# Altium project Power Board.PrjPcb
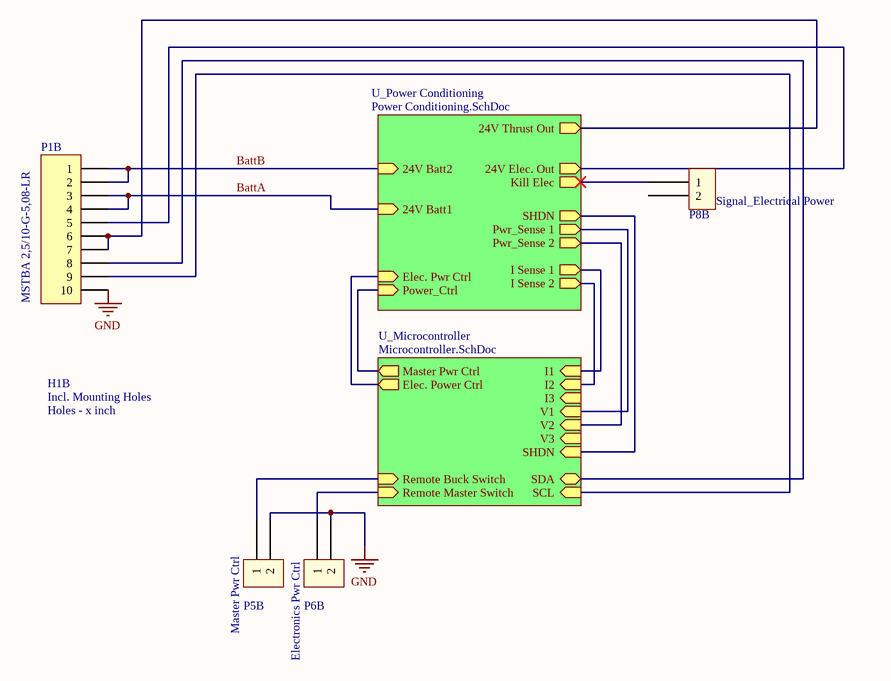
[diagram p0: Power Board.SchDoc]
4 sheets, 59 parts. Net scope: hierarchical (ports join the sheet entries above them; power ports are global).
Board file: Power Board.PcbDoc
Sheets:
  Power Board.SchDoc
    U_Microcontroller = Microcontroller.SchDoc
    U_Power Conditioning = Power Conditioning.SchDoc
      D = Diode Controllers.SchDoc
      D = Diode Controllers.SchDoc

## Sheet Power Board.SchDoc
size A; Organization: Underwater Robotics; Address1: c/o Student Involvement; Address2: Campus Box 7306; Address3: 2016 Cates Ave. Raleigh, NC 27695; Revision: A1; SheetNumber: 1B; SheetTotal: 4B

### Parts
H1B  Holes - x inch  [110mil Holes - 2.5  Inch]
P1B  Manufacturer Part Number: MSTBA 2,5/10-G-5,08-LR  [MSTBA 2,5/10-G-5,08]  (hidden comment: MSTBA 2,5/10-G-5,08)
P5B  Header  [1x2 Header]  (value not drawn)
P6B  Header  [1x2 Header]  (value not drawn)
P8B  Header  [1x2 Header]  (value not drawn)

### Sub-sheets
U_Microcontroller = Microcontroller.SchDoc: SDA (bidir), SCL (in), I1 (in), I2 (in), I3 (in), V1 (in), V2 (in), V3 (in), Master Pwr Ctrl (out), Elec. Power Ctrl (out), SHDN (in), Remote Buck Switch (in), Remote Master Switch (in)
U_Power Conditioning = Power Conditioning.SchDoc: 24V Elec. Out (out), Power_Ctrl (in), Pwr_Sense 1 (out), 24V Thrust Out (out), Pwr_Sense 2 (out), I Sense 1 (out), I Sense 2 (out), 24V Batt1 (in), 24V Batt2 (in), SHDN (out), Elec. Pwr Ctrl (in), Kill Elec (out)

### Nets
GND: P1B.10 P5B.2 P6B.2
BattA: P1B.3 P1B.4 ; sheet U_Power Conditioning/24V Batt1
BattB: P1B.1 P1B.2 ; sheet U_Power Conditioning/24V Batt2
Elec Pwr Ctrl Signal: P8B.1 ; sheet U_Microcontroller/Elec. Power Ctrl, sheet U_Power Conditioning/Elec. Pwr Ctrl, sheet U_Power Conditioning/Kill Elec
Rel1 Driver: sheet U_Microcontroller/Master Pwr Ctrl, sheet U_Power Conditioning/Power_Ctrl
SHDN_Signal: sheet U_Microcontroller/SHDN, sheet U_Power Conditioning/SHDN
NetP1B_5: P1B.5 ; sheet U_Power Conditioning/24V Elec. Out
NetP1B_6: P1B.6 P1B.7 ; sheet U_Power Conditioning/24V Thrust Out
NetP1B_8: P1B.8 ; sheet U_Microcontroller/SDA
NetP1B_9: P1B.9 ; sheet U_Microcontroller/SCL
NetP5B_1: P5B.1 ; sheet U_Microcontroller/Remote Buck Switch
NetP6B_1: P6B.1 ; sheet U_Microcontroller/Remote Master Switch
NetR1B_2: sheet U_Microcontroller/I1, sheet U_Power Conditioning/I Sense 1
NetR2B_2: sheet U_Microcontroller/I2, sheet U_Power Conditioning/I Sense 2
NetR4B_1: sheet U_Microcontroller/V1, sheet U_Power Conditioning/Pwr_Sense 1
NetR5B_1: sheet U_Microcontroller/V2, sheet U_Power Conditioning/Pwr_Sense 2

Not connected (* = marked no-connect by the designer): P8B 2

### Notes on the sheet
- (near P8B) Signal_Electrical Power
- (near P5B) Master Pwr Ctrl
- Electronics Pwr Ctrl
- Title
- Size:
- Date:
- A
- Number:
- Time:
- Revision:
- Sheet
- of
- File:
- (in symbol Holes - x inch) Incl. Mounting Holes

### Library data of the parts
P1B = MSTBA 2,5/10-G-5,08: Header, 10-Pin; Manufacturer 1: PHOENIX CONTACT; Description 1: PHOENIX CONTACT - MSTBA 2,5/10-G-5,08-LR - TERMINAL BLOCK, HEADER, 10POS, TH; URL: http://www.mouser.com/ProductDetail/Phoenix-Contact/1792708/?qs=sGAEpiMZZMsDddcp1dBDJI66tvLKBAoKnRJwuCPjeJk%3d; Supplier 1: Newark; Supplier Part Number 1: 88W5041; RoHS: YES; Stock 1: 37; Pricing 1: 1=3.07, 100=2.89, 250=2.67, 500=2.55, 1000=2.27 (USD); ComponentLink1URL: http://www.farnell.com/datasheets/1702208.pdf; ComponentLink1Description: http://www.farnell.com/datasheets/1702208.pdf
P5B P6B P8B = 1x2 Header

## Sheet Microcontroller.SchDoc
size A; Organization: Underwater Robotics; Address1: c/o Student Involvement; Address2: Campus Box 7306; Address3: 2016 Cates Ave. Raleigh, NC 27695; Revision: A1; SheetNumber: 2B; SheetTotal: 4B
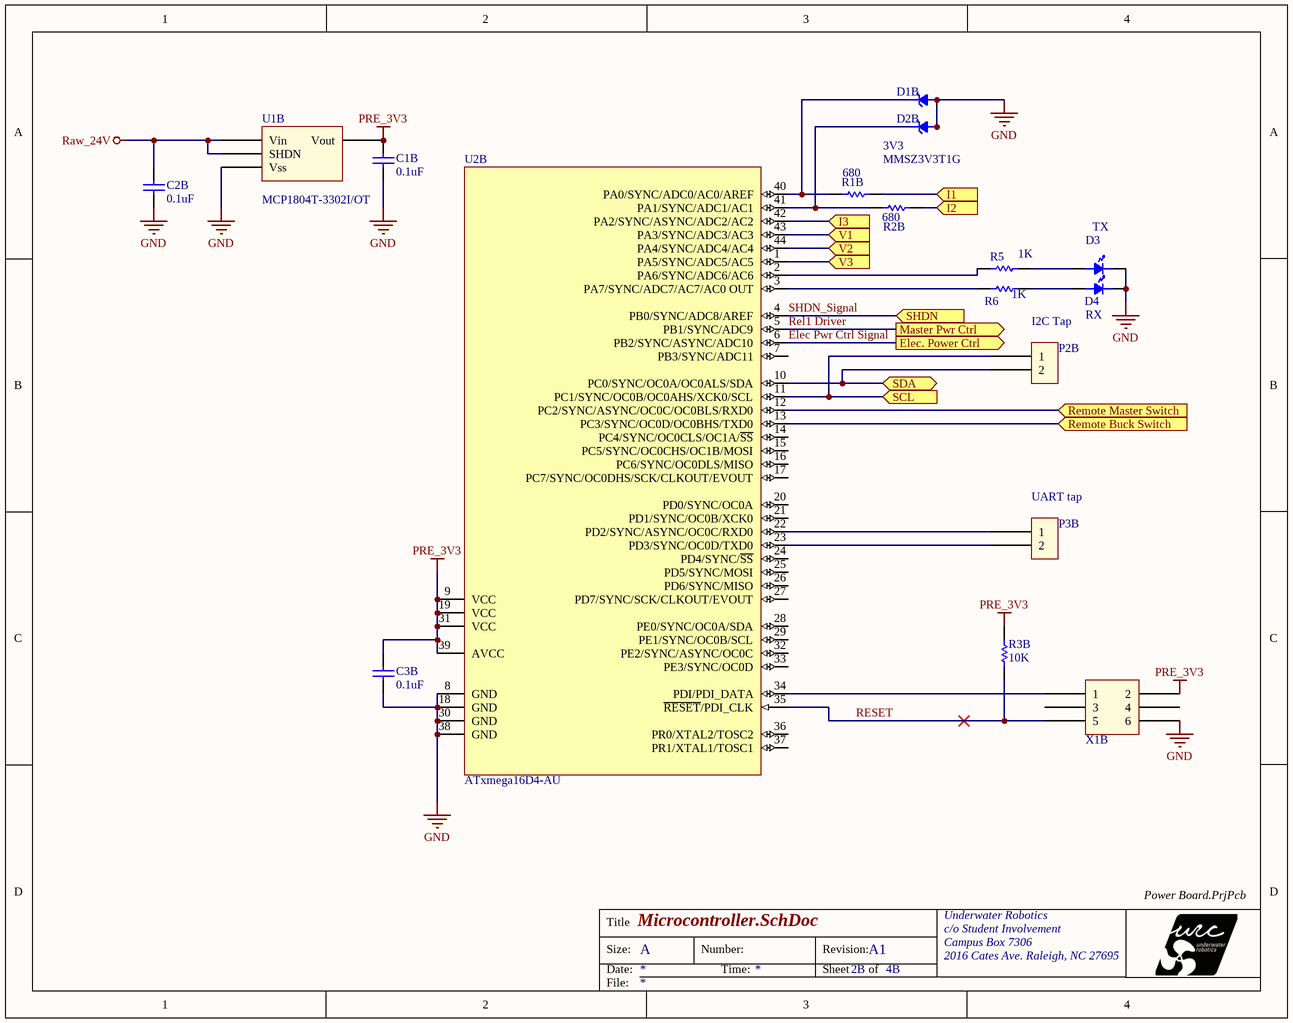
[diagram p1: Microcontroller.SchDoc]

### Parts
C1B  value 0.1uF  [C0805]  (hidden comment: 0.1uF, C0805, AVX)
C2B  value 0.1uF  [C0805]  (hidden comment: 0.1uF, C0805, AVX)
C3B  value 0.1uF  [C0805]  (hidden comment: 0.1uF, C0805, AVX)
D1B  value 3V3  Manufacturer Part Number: MMSZ3V3T1G  [ONSC-SOD123-2-498_A_V]  (hidden comment: MMSZ3V3T1G, 3V3 Zener Diode)
D2B  MMSZ3V3T1G, 3V3 Zener Diode  [ONSC-SOD123-2-498_A_V]  (value not drawn)
D3  LED  [LED0805]  (value not drawn)
D4  LED  [LED0805]  (value not drawn)
P2B  Header  [1x2 Header]  (value not drawn)
P3B  Header  [1x2 Header]  (value not drawn)
R1B  value 680  [R0603]  (hidden comment: Resistor)
R2B  value 680  [R0603]  (hidden comment: Resistor)
R3B  value 10K  [R0603]  (hidden comment: Resistor)
R5  value 1K  [R0603]  (hidden comment: Resistor)
R6  value 1K  [R0603]  (hidden comment: Resistor)
U1B  MCP1804T-3302I/OT  [MCP1804T-3302I/OT]
U2B  ATxmega16D4-AU  [44A_N]
X1B  Header  [2x3 Header]  (value not drawn)

### Ports
Elec. Power Ctrl (out), I1 (in), I2 (in), I3 (in), Master Pwr Ctrl (out), Remote Buck Switch (in), Remote Master Switch (in), SCL (in), SDA (bidir), SHDN (in), V1 (in), V2 (in), V3 (in)

### Nets
GND: C1B.2 C2B.2 C3B.2 D1B.A D2B.A D3.1 D4.1 U1B.Vss U2B.8(GND) U2B.18(GND) U2B.30(GND) U2B.38(GND) X1B.6
PRE_3V3: C1B.1(+) C3B.1(+) R3B.2 U1B.Vout U2B.9(VCC) U2B.19(VCC) U2B.31(VCC) U2B.39(AVCC) X1B.2
Raw_24V: C2B.1(+) U1B.SHDN U1B.Vin
Elec Pwr Ctrl Signal: U2B.6(PB2/SYNC/ASYNC/ADC10) ; port Elec. Power Ctrl
Rel1 Driver: U2B.5(PB1/SYNC/ADC9) ; port Master Pwr Ctrl
RESET: R3B.1 U2B.35(~{RESET}/PDI_CLK) X1B.5
SHDN_Signal: U2B.4(PB0/SYNC/ADC8/AREF) ; port SHDN
NetD1B_K: D1B.K R1B.1 U2B.40(PA0/SYNC/ADC0/AC0/AREF)
NetD2B_K: D2B.K R2B.1 U2B.41(PA1/SYNC/ADC1/AC1)
NetD3_2: D3.2 R5.2
NetD4_2: D4.2 R6.2
NetP1B_8: P2B.2 U2B.10(PC0/SYNC/OC0A/OC0ALS/SDA) ; port SDA
NetP1B_9: P2B.1 U2B.11(PC1/SYNC/OC0B/OC0AHS/XCK0/SCL) ; port SCL
NetP3B_1: P3B.1 U2B.22(PD2/SYNC/ASYNC/OC0C/RXD0)
NetP3B_2: P3B.2 U2B.23(PD3/SYNC/OC0D/TXD0)
NetP5B_1: U2B.13(PC3/SYNC/OC0D/OC0BHS/TXD0) ; port Remote Buck Switch
NetP6B_1: U2B.12(PC2/SYNC/ASYNC/OC0C/OC0BLS/RXD0) ; port Remote Master Switch
NetR1B_2: R1B.2 ; port I1
NetR2B_2: R2B.2 ; port I2
NetR4B_1: U2B.43(PA3/SYNC/ADC3/AC3) ; port V1
NetR5_1: R5.1 U2B.2(PA6/SYNC/ADC6/AC6)
NetR5B_1: U2B.44(PA4/SYNC/ADC4/AC4) ; port V2
NetR6_1: R6.1 U2B.3(PA7/SYNC/ADC7/AC7/AC0_OUT)
NetU2B_1: U2B.1(PA5/SYNC/ADC5/AC5) ; port V3
NetU2B_34: U2B.34(PDI/PDI_DATA) X1B.1
NetU2B_42: U2B.42(PA2/SYNC/ASYNC/ADC2/AC2) ; port I3

Not connected (* = marked no-connect by the designer): U2B 7(PB3/SYNC/ADC11) 14(PC4/SYNC/OC0CLS/OC1A/~{SS}) 15(PC5/SYNC/OC0CHS/OC1B/MOSI) 16(PC6/SYNC/OC0DLS/MISO) 17(PC7/SYNC/OC0DHS/SCK/CLKOUT/EVOUT) 20(PD0/SYNC/OC0A) 21(PD1/SYNC/OC0B/XCK0) 24(PD4/SYNC/~{SS}) 25(PD5/SYNC/MOSI) 26(PD6/SYNC/MISO) 27(PD7/SYNC/SCK/CLKOUT/EVOUT) 28(PE0/SYNC/OC0A/SDA) 29(PE1/SYNC/OC0B/SCL) 32(PE2/SYNC/ASYNC/OC0C) 33(PE3/SYNC/OC0D) 36(PR0/XTAL2/TOSC2) 37(PR1/XTAL1/TOSC1); X1B 3 4

### Notes on the sheet
- TX
- I2C Tap
- (near D4) RX
- (near P3B) UART tap
- Title
- Size:
- Date:
- A
- Number:
- Time:
- Revision:
- Sheet
- of
- File:

### Library data of the parts
C1B C2B C3B = 0.1uF, C0805, AVX: Ceramic MLCC, AVX, X5R Dielectric; Manufacturer Part Number: 08055C104JAT2A; Description 1: AVX - 08055C104JAT2A - MLCC CAPACITOR, 0.1uF, 50V, X7R, 5%, 0805; Capacitance: 0.1 F; Capacitance Tolerance: 5%; Dielectric Characteristic: X7; Voltage Rating: 50; Ceramic Capacitor Case: 0805 [2012 Metric]; Supplier 1: Newark; Supplier Part Number 1: 96K4778; Manufacturer 1: AVX; RoHS: YES; Stock 1: 26154; Pricing 1: 1=0.009, 10=0.009, 100=0.009, 250=0.009, 500=0.009, 1000=0.009 (USD); Product Range: -; Operating Temperature Min: -55 C; ComponentLink1URL: http://www.farnell.com/datasheets/1818074.pdf; ComponentLink1Description: http://www.farnell.com/datasheets/1818074.pdf
D1B D2B = MMSZ3V3T1G, 3V3 Zener Diode: 3V3 Zener Diode; Manufacturer 1: ON SEMICONDUCTOR; Description 1: ON SEMICONDUCTOR - MMSZ3V3T1G - ZENER DIODE, 500mW, 3.3V, SOD-123; Supplier 1: Newark; Supplier Part Number 1: 71J6023; RoHS: YES; Stock 1: 30308; Pricing 1: 1=0.24, 50=0.156, 100=0.065, 250=0.063, 500=0.061, 1000=0.044, 3000=0.035, 9000=0.029 (USD); ComponentLink1URL: http://www.farnell.com/datasheets/78656.pdf; ComponentLink1Description: http://www.farnell.com/datasheets/78656.pdf
  D2B: Manufacturer Part Number: MMSZ3V3T1G; Value: 3V3
P2B P3B = 1x2 Header
R1B R2B = 680, 5%, 100mW, Yageo, R0603: Manufacturer 1: YAGEO; Manufacturer Part Number: RC0603JR-07680RL; Tolerance: 5%; Description 1: YAGEO - RC0603JR-07680RL - RES, THICK FILM, 680R, 5%, 0.1W, 0603; Product Range: RC Series; Power Rating: 100; Voltage Rating: 50; Resistor Case Style: 0603 [1608 Metric]; Body Width: 0.8; Supplier 1: Newark; Supplier Part Number 1: 68R0206; RoHS: YESX; Stock 1: 8787; Pricing 1: 1=0.07, 10=0.012, 25=0.008, 100=0.005, 250=0.004, 1000=0.002 (USD); Resistance: 680; Resistance Tolerance: 5%; Packaging: Cut Tape; MSL: -; ComponentLink1URL: http://past.yageo.com/pdf/PYu-R_Packing_6.pdf; ComponentLink1Description: http://past.yageo.com/pdf/PYu-R_Packing_6.pdf; ComponentLink2URL: http://www.farnell.com/cad/1538988.zip; ComponentLink2Description: http://www.farnell.com/cad/1538988.zip; ComponentLink3URL: http://www.farnell.com/datasheets/1868787.pdf; ComponentLink3Description: http://www.farnell.com/datasheets/1868787.pdf; ComponentLink4URL: http://www.yageo.com/pdf/PYu-RC0603_51_RoHS_L_4.pdf; ComponentLink4Description: http://www.yageo.com/pdf/PYu-RC0603_51_RoHS_L_4.pdf
R3B = 10k, 1%, 100mW, Yageo, R0603: Manufacturer 1: YAGEO; Manufacturer Part Number: RC0603FR-1010KL; Tolerance: 1%; Description 1: YAGEO - RC0603FR-1010KL - RES, THICK FILM, 10K, 1%, 0.1W, 0603; Product Range: RC Series; Resistance: 10; Power Rating: 100; Voltage Rating: 50; Resistor Case Style: 0603 [1608 Metric]; Body Length: 1.6; Supplier 1: Newark; Supplier Part Number 1: 68R0120; RoHS: YESX; Stock 1: 7839; Pricing 1: 1=0.002, 10=0.002, 25=0.002, 100=0.002, 250=0.002, 1000=0.002 (USD); Resistance Tolerance: 1%; Packaging: Cut Tape; MSL: -; ComponentLink1URL: http://www.farnell.com/datasheets/1868787.pdf; ComponentLink1Description: http://www.farnell.com/datasheets/1868787.pdf; ComponentLink2URL: http://www.yageo.com/pdf/PYu-RC0603_51_RoHS_L_4.pdf; ComponentLink2Description: http://www.yageo.com/pdf/PYu-RC0603_51_RoHS_L_4.pdf
R5 R6 = 1k, 5%, 100mW, Yageo, R0603: Manufacturer 1: YAGEO; Manufacturer Part Number: RC0603JR-131KL; Tolerance: 5%; Description 1: YAGEO - RC0603JR-131KL - RES, THICK FILM, 1K, 5%, 0.1W, 0603; Product Range: RC Series; Resistance: 1; Power Rating: 100; Voltage Rating: 50; Resistor Case Style: 0603 [1608 Metric]; Body Height: 0.45; Supplier 1: Newark; Supplier Part Number 1: 68R0220; RoHS: YESX; Stock 1: 36430; Pricing 1: 1=0.06, 10=0.011, 25=0.008, 100=0.005, 250=0.003, 1000=0.002 (USD); Resistance Tolerance: 5%; Packaging: Cut Tape; MSL: -; ComponentLink1URL: http://www.farnell.com/datasheets/1868787.pdf; ComponentLink1Description: http://www.farnell.com/datasheets/1868787.pdf; ComponentLink2URL: http://www.yageo.com/pdf/PYu-RC0603_51_RoHS_L_4.pdf; ComponentLink2Description: http://www.yageo.com/pdf/PYu-RC0603_51_RoHS_L_4.pdf
U1B = MCP1804T-3302I/OT: 3.3V Linear Regulator; Manufacturer 1: MICROCHIP; Description 1: MICROCHIP - MCP1804T-3302I/OT - LDO VOLTAGE REGULATOR, 3.3V, 150mA, 5-SOT-23; Input Voltage Min: 2; Input Voltage Max: 28; Output Current: 150; Dropout Voltage Vdo: 260; LDO Regulator Case Style: SOT-23; No. of Pins: 5; URL: http://www.newark.com/microchip/mcp1804t-3302i-ot/ldo-voltage-regulator-3-3v-150ma/dp/55R1047; Supplier 1: Newark; Supplier Part Number 1: 55R1047; RoHS: YES; Stock 1: 12; Pricing 1: 1=0.67, 26=0.56, 100=0.51 (USD); Operating Temperature Min: -40 C; ComponentLink1URL: http://www.farnell.com/datasheets/1789199.pdf; ComponentLink1Description: http://www.farnell.com/datasheets/1789199.pdf; ComponentLink2URL: http://www.farnell.com/cad/1790647.zip; ComponentLink2Description: http://www.farnell.com/cad/1790647.zip; Manufacturer Part Number: MCP1804T-3302I/OT
U2B = ATxmega16D4-AU: 8/16-bit AVR XMEGA D4 Microcontroller, 1.6-3.6V, 32MHz, 16KB + 4KB Flash, 1KB EEPROM, 2KB SRAM, 44-pin TQFP, Industrial Grade (-40°C to 85°C), Pb-Free; Manufacturer 1: ATMEL; Description 1: ATMEL - ATXMEGA16D4-AU - MICROCONTROLLER MCU, 8 BIT, AVR XMEGA, 32MHZ, TQFP-44; CPU Speed: 32; Program Memory Size: 16; RAM Memory Size: 2; No. of Pins: 44; No. of I/O's: 34; Supply Voltage Min: 1.6; DatasheetVersion: revJ, Dec-2010; PackageVersion: revC, Oct-2010; PackageReference: 44A; PackageDescription: 44-Pin Plastic Thin Profile Quad Flat Pack, 10 x 10 x 1.0 mm Body, 0.8 mm Pitch (TQFP); Code_JEDEC: MS-026-ACB; ComponentLink1Description: Manufacturer URL; ComponentLink1URL: http://www.atmel.com/; ComponentLink2Description: ATxmega128D4/64D4/32D4/16D4 Datasheet; ComponentLink2URL: http://www.atmel.com/dyn/resources/prod_documents/doc8135.pdf; Supplier 1: Newark; Supplier Part Number 1: 68T3906; Manufacturer Part Number: ATXMEGA16D4-AU; RoHS: YES; Stock 1: 196; Pricing 1: 1=2.71, 10=2.38, 25=2.24, 50=1.9, 100=1.79, 250=1.72, 500=1.69, 1000=1.49 (USD); Controller Family/Series: ATxmega; MCU Case Style: TQFP; ComponentLink3URL: http://www.farnell.com/datasheets/1693882.pdf; ComponentLink3Description: http://www.farnell.com/datasheets/1693882.pdf; ComponentLink4URL: http://www.farnell.com/cad/1773743.zip; ComponentLink4Description: http://www.farnell.com/cad/1773743.zip; ComponentLink5URL: http://bcove.me/gu8hm7kh; ComponentLink5Description: http://bcove.me/gu8hm7kh
X1B = 2x3 Header: Manufacturer 1: FCI; Manufacturer Part Number: 67996-406HLF; Description 1: FCI - 67996-406HLF - BOARD-BOARD CONNECTOR HEADER, 6 POSITION, 2ROW; Product Range: BergStik 67996 Series; Contact Termination Type: Through Hole; No. of Contacts: 6; Pitch Spacing: 2.54; No. of Rows: 2; Supplier Part Number 1: 20M2191; Supplier 1: Newark; RoHS: YES; Stock 1: 441; Pricing 1: 1=0.254, 10=0.218, 25=0.186, 50=0.178, 100=0.16, 250=0.153, 500=0.128, 1000=0.117 (USD); Gender: Header; Contact Plating: Tin Plated Contacts; ComponentLink1URL: http://www.farnell.com/datasheets/1876884.pdf; ComponentLink1Description: http://www.farnell.com/datasheets/1876884.pdf

## Sheet Power Conditioning.SchDoc
size A; Organization: Underwater Robotics; Address1: c/o Student Involvement; Address2: Campus Box 7306; Address3: 2016 Cates Ave. Raleigh, NC 27695; Revision: A1; SheetNumber: 3B; SheetTotal: 3B; PageSetup: Record=PageOptions|CenterHorizontal=True|CenterVertical=True|PrintScale=1.00|XCorrection=1.00|YCorrection=1.00|PrintKind=0|BorderSize=5000000|LeftOffset=0|BottomOffset=0|Orientation=2|PaperLength=1000|PaperWidth=1000|Scale=100|PaperSource=7|PrintQuality=-3|MediaType=1|DitherType=10|PrintScaleMode=1|PaperKind=Letter|PaperIndex=1
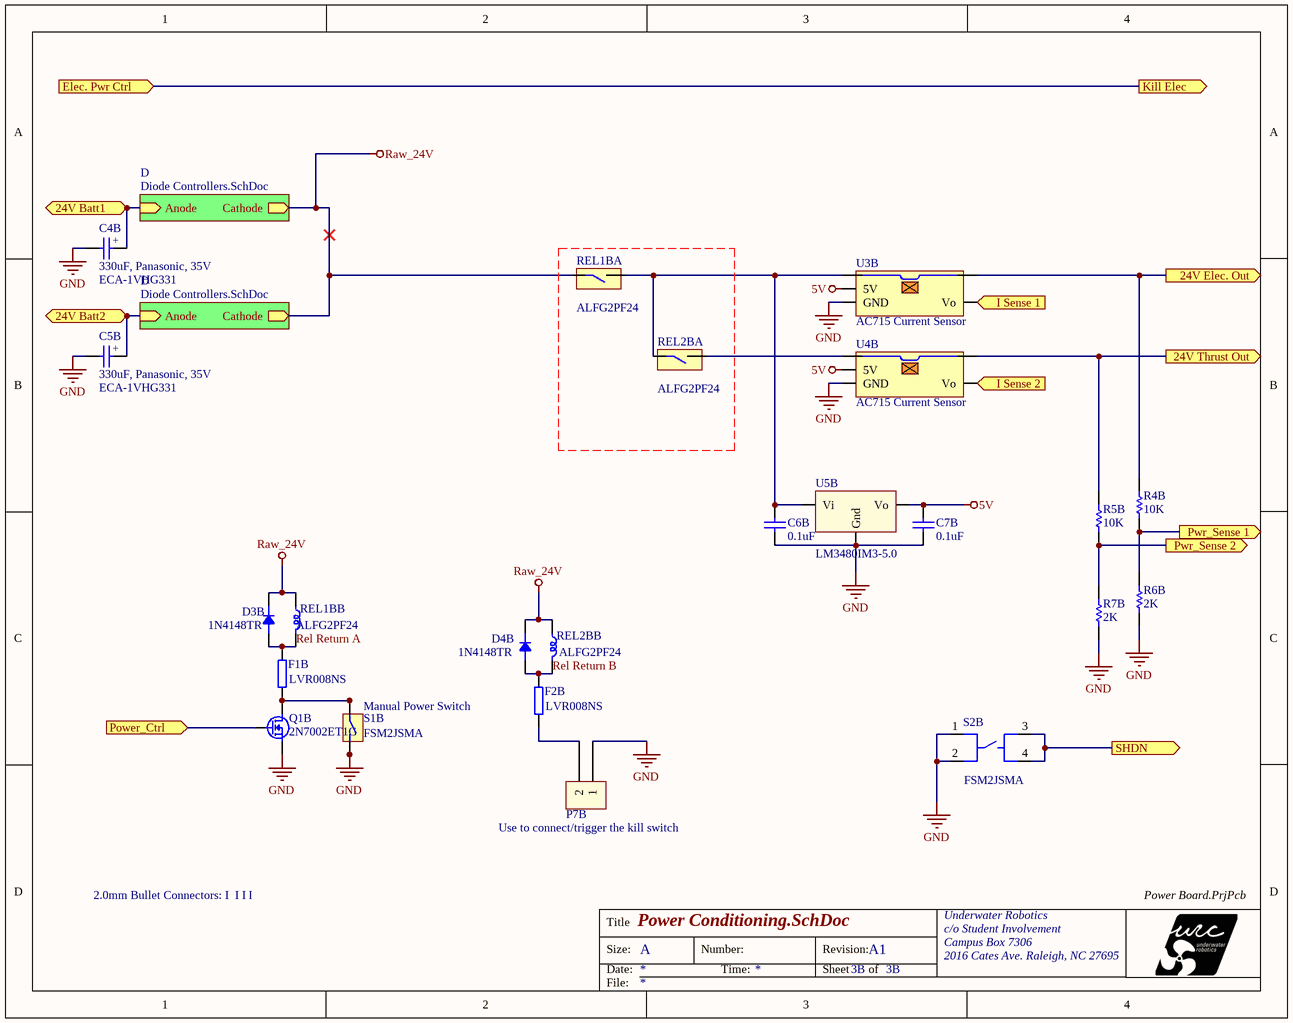
[diagram p2: Power Conditioning.SchDoc]

### Parts
C4B  330uF, Panasonic, 35V  Manufacturer Part Number: ECA-1VHG331  [10mm Radial Cap, Generic]
C5B  330uF, Panasonic, 35V  Manufacturer Part Number: ECA-1VHG331  [10mm Radial Cap, Generic]
C6B  value 0.1uF  [C0805]  (hidden comment: 0.1uF, C0805, AVX)
C7B  value 0.1uF  [C0805]  (hidden comment: 0.1uF, C0805, AVX)
D3B  Manufacturer Part Number: 1N4148TR  [DO-35-0.3]  (hidden comment: Diode)
D4B  Manufacturer Part Number: 1N4148TR  [DO-35-0.3]  (hidden comment: Diode)
F1B  Manufacturer Part Number: LVR008NS  [LVR008NS - Resettable Fuse]  (hidden comment: PTC Fuse, LVR008NS)
F2B  Manufacturer Part Number: LVR008NS  [LVR008NS - Resettable Fuse]  (hidden comment: PTC Fuse, LVR008NS)
i1B  2.0mm Bullet Connector (Placeholder)  (value not drawn)
i2B  2.0mm Bullet Connector (Placeholder)  (value not drawn)
i3B  2.0mm Bullet Connector (Placeholder)  (value not drawn)
i4B  2.0mm Bullet Connector (Placeholder)  (value not drawn)
P7B  Header  [1x2 Header]  (value not drawn)
Q1B  Manufacturer Part Number: 2N7002ET1G  [2N7002-SOT23]  (hidden comment: N-MOSFET)
R4B  value 10K  [R0603]  (hidden comment: Resistor)
R5B  value 10K  [R0603]  (hidden comment: Resistor)
R6B  value 2K  [R0603]  (hidden comment: Resistor)
R7B  value 2K  [R0603]  (hidden comment: Resistor)
REL1B  ALFG2PF24  [LF-G Series Relay]  (parts A,B of 2)
REL2B  ALFG2PF24  [LF-G Series Relay]  (parts A,B of 2)
S1B  FSM2JSMA  [FSM2JSMA]
S2B  FSM2JSMA  [FSM2JSMA]
U3B  AC715 Current Sensor  [AC715 Current Sensor]
U4B  AC715 Current Sensor  [AC715 Current Sensor]
U5B  Manufacturer Part Number: LM3480IM3-5.0  [LM4040-SOT23-3]  (hidden comment: LM3480)

### Sub-sheets
D = Diode Controllers.SchDoc: Anode (in), Cathode (out)
D = Diode Controllers.SchDoc: Anode (in), Cathode (out)

### Ports
24V Batt1 (in), 24V Batt2 (in), 24V Elec. Out (out), 24V Thrust Out (out), Elec. Pwr Ctrl (in), I Sense 1 (out), I Sense 2 (out), Kill Elec (out), Power_Ctrl (in), Pwr_Sense 1 (out), Pwr_Sense 2 (out), SHDN (out)

### Nets
5V: C7B.1(+) U3B.5(5V) U4B.5(5V) U5B.2(Vo)
GND: C4B.2 C5B.2 C6B.2 C7B.2 P7B.1 Q1B.S(SOURCE) R6B.1 R7B.1 S1B.3 S1B.4 S2B.1 S2B.2 U3B.3(GND) U4B.3(GND) U5B.1(Gnd)
Raw_24V: D3B.2 D4B.2 REL1B.2 REL1B.4 REL2B.2 ; sheet D/Cathode, sheet D/Cathode
BattA: C4B.1(+) ; port 24V Batt1, sheet D/Anode
BattB: C5B.1(+) ; port 24V Batt2, sheet D/Anode
Elec Pwr Ctrl Signal: port Elec. Pwr Ctrl, port Kill Elec
Rel1 Driver: Q1B.G(GATE) ; port Power_Ctrl
Rel Return A: D3B.1 F1B.1 REL1B.1
Rel Return B: D4B.1 F2B.1 REL2B.1
SHDN_Signal: S2B.3 S2B.4 ; port SHDN
NetC6B_1: C6B.1(+) REL1B.3 REL2B.4 U3B.1 U5B.3(Vi)
NetF1B_2: F1B.2 Q1B.D(DRAIN) S1B.1 S1B.2
NetF2B_2: F2B.2 P7B.2
NetP1B_5: R4B.2 U3B.2 ; port 24V Elec. Out
NetP1B_6: R5B.2 U4B.2 ; port 24V Thrust Out
NetR1B_2: U3B.4(Vo) ; port I Sense 1
NetR2B_2: U4B.4(Vo) ; port I Sense 2
NetR4B_1: R4B.1 R6B.2 ; port Pwr_Sense 1
NetR5B_1: R5B.1 R7B.2 ; port Pwr_Sense 2
NetREL2B_3: REL2B.3 U4B.1

### Notes on the sheet
- (near S1B) Manual Power Switch
- (near P7B) Use to connect/trigger the kill switch
- Title
- Size:
- Date:
- A
- Number:
- Time:
- Revision:
- Sheet
- of
- File:
- (in symbol 2.0mm Bullet Connector (Placeholder)) 2.0mm Bullet Connectors: I; I

### Library data of the parts
C4B C5B = 330uF, Panasonic, 35V: Manufacturer 1: PANASONIC ELECTRONIC COMPONENTS; Description 1: PANASONIC ELECTRONIC COMPONENTS - ECA-1VHG331 - ALUMINUM ELECTROLYTIC CAPACITOR, 330UF, 20%, 35V, RADIAL; Product Range: NHG Series; Capacitance: 330 F; Capacitance Tolerance: 20%; Voltage Rating: 35; Capacitor Terminals: Radial Leaded; Supplier 1: Newark; Supplier Part Number 1: 17T5027; RoHS: YES; Stock 1: 465; Pricing 1: 1=0.575, 10=0.38, 25=0.324, 50=0.276, 100=0.246, 250=0.213, 500=0.182, 1000=0.147 (USD); Diameter: 10; Packaging: Each; ESR: -; ComponentLink1URL: http://www.farnell.com/cad/1703906.zip; ComponentLink1Description: http://www.farnell.com/cad/1703906.zip; ComponentLink2URL: http://www.farnell.com/datasheets/1903322.pdf; ComponentLink2Description: http://www.farnell.com/datasheets/1903322.pdf
C6B C7B = 0.1uF, C0805, AVX: as C1B on sheet Microcontroller; Supplier 1: Newark; Supplier Part Number 1: 96K4778; Manufacturer 1: AVX; RoHS: YES; Stock 1: 26154; Pricing 1: 1=0.009, 10=0.009, 100=0.009, 250=0.009, 500=0.009, 1000=0.009 (USD); Product Range: -; Operating Temperature Min: -55 C; ComponentLink1URL: http://www.farnell.com/datasheets/1818074.pdf; ComponentLink1Description: http://www.farnell.com/datasheets/1818074.pdf
D3B D4B = Diode: General Purpose Diode; Manufacturer 1: FAIRCHILD SEMICONDUCTOR; Description 1: FAIRCHILD SEMICONDUCTOR - 1N4148TR - SMALL SIGNAL DIODE 100V 200mA DO-35; Diode Configuration: Single; Repetitive Reverse Voltage Vrrm Max: 100; Forward Current If(AV): 200; Forward Voltage VF Max: 1; Reverse Recovery Time trr Max: 4; Supplier 1: Newark; Supplier Part Number 1: 05R0353; RoHS: YES; Stock 1: 12584; Pricing 1: 1=0.063, 10=0.052, 100=0.018, 1000=0.013, 2500=0.01 (USD); Forward Surge Current Ifsm Max: 4; ComponentLink1URL: http://www.farnell.com/datasheets/1934602.pdf; ComponentLink1Description: http://www.farnell.com/datasheets/1934602.pdf; ComponentLink2URL: http://www.fairchildsemi.com/ds/1N%2F1N4148.pdf; ComponentLink2Description: http://www.fairchildsemi.com/ds/1N%2F1N4148.pdf
F1B F2B = PTC Fuse, LVR008NS: Generic Fuse; Manufacturer 1: TE CONNECTIVITY / RAYCHEM; Description 1: TE CONNECTIVITY / RAYCHEM - LVR008NS - FUSE, PTC RESET, 240V, 80mA, RADIAL; Product Range: PolySwitch LVR Series; Holding Current: 80; Tripping Current: 190; Voltage Rating: 240; Thermistor Mounting: Through Hole; External Depth: 4.6; Supplier 1: Newark; Supplier Part Number 1: 45P7788; RoHS: YES; Stock 1: 919; Pricing 1: 1=0.46, 10=0.46, 100=0.409, 500=0.369, 1000=0.318, 2000=0.312, 5000=0.29, 10000=0.247 (USD); Operating Temperature Min: -40 C; ComponentLink1URL: http://www.farnell.com/datasheets/1902602.pdf; ComponentLink1Description: http://www.farnell.com/datasheets/1902602.pdf
i1B i2B i3B i4B = 2.0mm Bullet Connector (Placeholder): Typical 2.0mm bullet connector used in RC Electronics; Supplier 1: eBay; URL: http://www.ebay.com/itm/2-0mm-Gold-Plated-Bullet-Banana-Plug-Connector-for-RC-Battery-10-Pairs-EM-01-/380940680315?hash=item58b1d57c7b:g:4qgAAOSwqu9U~~mJ; Supplier Unit Price 1: 0.319; Supplier Part Number 1: 884853846561
P7B = 1x2 Header
Q1B = N-MOSFET: N-Channel MOSFET; Manufacturer 1: ON SEMICONDUCTOR; Description 1: ON SEMICONDUCTOR - 2N7002ET1G - N CHANNEL MOSFET, 60V, 310mA SOT-23; Supplier Part Number 1: 09R9861; Supplier 1: Newark; RoHS: YES; Stock 1: 18061; Pricing 1: 1=0.018, 50=0.018, 100=0.018, 250=0.018, 500=0.018, 1000=0.018, 3000=0.016, 9000=0.016 (USD); ComponentLink1URL: http://www.farnell.com/datasheets/1708226.pdf; ComponentLink1Description: http://www.farnell.com/datasheets/1708226.pdf
R4B R5B = 10k, 1%, 100mW, Yageo, R0603: as R3B on sheet Microcontroller; Supplier 1: Newark; Supplier Part Number 1: 68R0120; RoHS: YESX; Stock 1: 7839; Pricing 1: 1=0.002, 10=0.002, 25=0.002, 100=0.002, 250=0.002, 1000=0.002 (USD); Resistance Tolerance: 1%; Packaging: Cut Tape; MSL: -; ComponentLink1URL: http://www.farnell.com/datasheets/1868787.pdf; ComponentLink1Description: http://www.farnell.com/datasheets/1868787.pdf; ComponentLink2URL: http://www.yageo.com/pdf/PYu-RC0603_51_RoHS_L_4.pdf; ComponentLink2Description: http://www.yageo.com/pdf/PYu-RC0603_51_RoHS_L_4.pdf
R6B R7B = 2k, 1%, 100mW, Yageo, R0603: Manufacturer 1: YAGEO; Manufacturer Part Number: RC0603FR-072KL; Tolerance: 1%; Description 1: YAGEO - RC0603FR-072KL - RES, THICK FILM, 2K, 1%, 0.1W, 0603; Supplier 1: Newark; Supplier Part Number 1: 68R0063; RoHS: YESX; Stock 1: 2730; Pricing 1: 1=0.09, 10=0.015, 25=0.011, 100=0.006, 250=0.004, 1000=0.003 (USD); ComponentLink1URL: http://www.farnell.com/datasheets/1868787.pdf; ComponentLink1Description: http://www.farnell.com/datasheets/1868787.pdf; ComponentLink2URL: http://www.yageo.com/pdf/PYu-RC0603_51_RoHS_L_4.pdf; ComponentLink2Description: http://www.yageo.com/pdf/PYu-RC0603_51_RoHS_L_4.pdf
REL1B REL2B = ALFG2PF24: 24V, 33A General Purpose Relay; Manufacturer 1: PANASONIC ELECTRIC WORKS; Description 1: PANASONIC ELECTRIC WORKS - ALFG2PF24 - RELAY, SPST-NO, 277VAC, 31A; Supplier 1: Newark; Supplier Part Number 1: 31T8165; RoHS: YES; Stock 1: 55; Pricing 1: 1=6.62, 100=5.41, 250=4.96, 500=4.61, 1000=4.33 (USD); ComponentLink1URL: http://www.farnell.com/datasheets/1022057.pdf; ComponentLink1Description: http://www.farnell.com/datasheets/1022057.pdf; ComponentLink2URL: http://www.farnell.com/datasheets/1012515.pdf; ComponentLink2Description: http://www.farnell.com/datasheets/1012515.pdf; Manufacturer Part Number: ALFG2PF24
S1B S2B = FSM2JSMA: Tactile Switch (OFF-MOM); Manufacturer 1: TE CONNECTIVITY / ALCOSWITCH; Description 1: TE CONNECTIVITY / ALCOSWITCH - FSM2JSMA - SWITCH, TACTILE, SPST-NO, 50mA, SMD; URL: http://search.digikey.com/us/en/products/FSM2JSMA/450-1130-ND/525819; Supplier 1: Newark; Supplier Part Number 1: 92F2864; Manufacturer Part Number: FSM2JSMA; RoHS: YES; Stock 1: 273; Pricing 1: 1=0.28, 10=0.262, 25=0.253, 50=0.244, 100=0.23, 250=0.217, 500=0.208, 1000=0.158 (USD); ComponentLink1URL: http://www.tycoelectronics.com/commerce/DocumentDelivery/DDEController?Action=showdoc&DocId=Catalog+Section%7F1308111-1_SWITCHES_CORE_PROGRAM_CATALOG%7F0308%7Fpdf%7FEnglish%7FENG_CS_1308111-1_SWITCHES_CORE_PROGRAM_CATALOG_0308.pdf%7F1825041-1; ComponentLink1Description: http://www.tycoelectronics.com/commerce/DocumentDelivery/DDEController?Action=showdoc&DocId=Catalog+Section%7F1308111-1_SWITCHES_CORE_PROGRAM_CATALOG%7F0308%7Fpdf%7FEnglish%7FENG_CS_1308111-1_SWITCHES_CORE_PROGRAM_CATALOG_0308.pdf%7F1825041-1; ComponentLink2URL: http://www.farnell.com/cad/1650702.pdf; ComponentLink2Description: http://www.farnell.com/cad/1650702.pdf; ComponentLink3URL: http://www.farnell.com/datasheets/1668117.pdf; ComponentLink3Description: http://www.farnell.com/datasheets/1668117.pdf; ComponentLink4URL: http://www.farnell.com/datasheets/921681.pdf; ComponentLink4Description: http://www.farnell.com/datasheets/921681.pdf; ComponentLink5URL: http://ecommas.tycoelectronics.com/commerce/DocumentDelivery/DDEController?Action=showdoc&DocId=Catalog+Page%7F1308390_0904_E3_E10%7Fn%2Fa%7Fpdf%7FEnglish%7FENG_CAT_1308390_0904_E3_E10_.pdf; ComponentLink5Description: http://ecommas.tycoelectronics.com/commerce/DocumentDelivery/DDEController?Action=showdoc&DocId=Catalog+Page%7F1308390_0904_E3_E10%7Fn%2Fa%7Fpdf%7FEnglish%7FENG_CAT_1308390_0904_E3_E10_.pdf
U3B U4B = AC715 Current Sensor: Manufacturer Part Number: 1186; Supplier Unit Price 1: 9.95; Supplier Part Number 1: 1186; Supplier 1: Pololu
U5B = LM3480: 5V, 0.1A Fixed LDO; pin to pad: 1>3 2>1 3>2; Manufacturer 1: TEXAS INSTRUMENTS; Description 1: TEXAS INSTRUMENTS - LM3480IM3-5.0 - LDO VOLTAGE REGULATOR, 5V, 0.1A, 3-SOT-23; Input Voltage Min: 0; Input Voltage Max: 30; Output Current: 100; Dropout Voltage Vdo: 900; LDO Regulator Case Style: SOT-23; No. of Pins: 3; Supplier 1: Newark; RoHS: NO; Stock 1: 132; Pricing 1: 1=1.24, 10=0.986, 100=0.757, 1000=0.529 (USD); ComponentLink1URL: http://www.farnell.com/cad/1562346.zip; ComponentLink1Description: http://www.farnell.com/cad/1562346.zip; Supplier Part Number 1: 83F3816; Operating Temperature Min: -40 C; ComponentLink2URL: http://www.farnell.com/datasheets/1853525.pdf; ComponentLink2Description: http://www.farnell.com/datasheets/1853525.pdf

## Sheet Diode Controllers.SchDoc
size A; Organization: Underwater Robotics; Address1: c/o Student Involvement; Address2: Campus Box 7306; Address3: 2016 Cates Ave. Raleigh, NC 27695; Revision: A1; SheetNumber: 4B; SheetTotal: 4B
Used 2 times, as channels U_Power Conditioning/D, U_Power Conditioning/D. Parts and nets are listed once, with the designators drawn on the sheet.
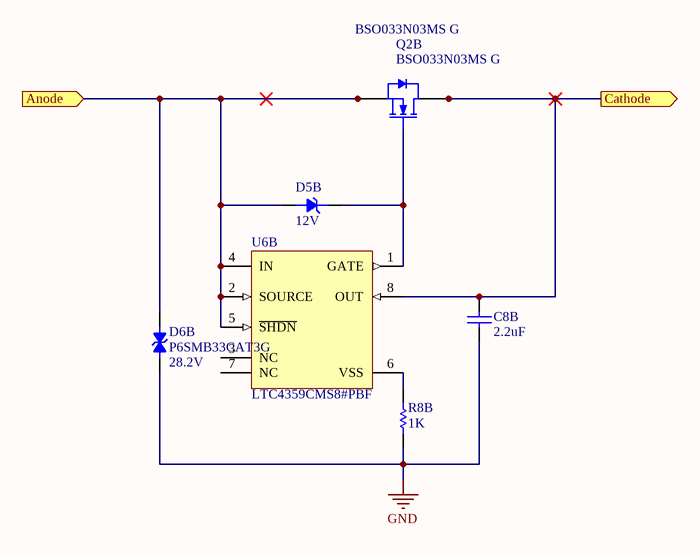
[diagram p3: Diode Controllers.SchDoc]

### Parts
C8B  value 2.2uF  [C1206]  (hidden comment: 2.2uF, C1206 TY , Ceramic MLCC)
D5B  Zener Voltage Vz Typ: 12V  [ONSC-SOD-523-2-502-01_C_V]  (hidden comment: MM5Z12VT1G, 12V Zener)
D6B  value 28.2V  Manufacturer Part Number: P6SMB33CAT3G  [ONSC-SMB-2-403A-03_H_V]  (hidden comment: Bidirectional Zener)
Q2B  BSO033N03MS G  [INF-PG-DSO-8-3_N]
R8B  value 1K  [R0603]  (hidden comment: Resistor)
U6B  LTC4359CMS8#PBF  [LT-MS8-8_N]

### Ports
Anode (in), Cathode (out)

### Nets
GND: C8B.1(+) D6B.2 R8B.1
Anode: D5B.1 D6B.1 Q2B.1(SOURCE) Q2B.2(SOURCE) Q2B.3(SOURCE) U6B.2(SOURCE) U6B.4(IN) U6B.5(~{SHDN}) ; port Anode
Cathode: C8B.2 Q2B.5(DRAIN) Q2B.6(DRAIN) Q2B.7(DRAIN) Q2B.8(DRAIN) U6B.8(OUT) ; port Cathode
NetD5B_2: D5B.2 Q2B.4(GATE) U6B.1(GATE)
NetR8B_2: R8B.2 U6B.6(VSS)

Not connected (* = marked no-connect by the designer): U6B 3(NC) 7(NC)

### Channels
U_Power Conditioning/D: designators end in B; ports Anode=BattB Cathode=Raw_24V
U_Power Conditioning/D: designators end in A; ports Anode=BattA Cathode=Raw_24V

### Notes on the sheet
- Title
- Size:
- Date:
- A
- Number:
- Time:
- Revision:
- Sheet
- of
- File:

### Library data of the parts
C8B = 2.2uF, C1206 TY , Ceramic MLCC: Ceramic MLCC, Taiyo Yuden, X7R Dielectric; Manufacturer Part Number: UMK316F225ZG-T; Description 1: TAIYO YUDEN - UMK316F225ZG-T - CERAMIC CAPACITOR, 2.2UF, 50V, Y5V, +80,-20%, 1206; Supplier 1: Newark; Supplier Part Number 1: 08P5201; Manufacturer 1: TAIYO YUDEN; RoHS: YES; Stock 1: 1843; Pricing 1: 1=0.055, 10=0.055, 50=0.055, 100=0.055, 500=0.055, 1000=0.05 (USD); ComponentLink1URL: http://www.yuden.co.jp/productdata/catalog/en/mlcc_pack_e.pdf; ComponentLink1Description: http://www.yuden.co.jp/productdata/catalog/en/mlcc_pack_e.pdf; ComponentLink2URL: http://www.farnell.com/datasheets/1481447.pdf; ComponentLink2Description: http://www.farnell.com/datasheets/1481447.pdf
D5B = MM5Z12VT1G, 12V Zener: Zener diode; Manufacturer 1: ON SEMICONDUCTOR; Description 1: ON SEMICONDUCTOR - MM5Z12VT1G - ZENER DIODE, 200mW, 12V, SOD-523; Power Dissipation Pd: 200; Diode Case Style: SOD-523; No. of Pins: 2; Filter Terminals: SMD; Supplier 1: Newark; Supplier Part Number 1: 09R9512; RoHS: YES; Stock 1: 4492; Pricing 1: 1=0.249, 50=0.162, 100=0.068, 250=0.066, 500=0.064, 1000=0.046, 3000=0.037, 9000=0.03 (USD); Zener Tolerance: -; Operating Temperature Max: 150 C; Packaging: Cut Tape; ComponentLink1URL: http://www.farnell.com/datasheets/1840567.pdf; ComponentLink1Description: http://www.farnell.com/datasheets/1840567.pdf; Manufacturer Part Number: MM5Z12VT1G
D6B = P6SMB33CAT3G 28.2V Bidirectional Zener: Bidirectional Zener diode; Manufacturer 1: ON SEMICONDUCTOR; Description 1: ON SEMICONDUCTOR - P6SMB33CAT3G - TVS DIODE, 600W, 33V, SMB; Supplier 1: Newark; Supplier Part Number 1: 42K2552; RoHS: YES; Stock 1: 6401; Pricing 1: 1=0.543, 50=0.36, 100=0.202, 250=0.195, 500=0.19, 1000=0.151, 2500=0.13, 7500=0.126 (USD); ComponentLink1URL: http://www.farnell.com/datasheets/1576153.pdf; ComponentLink1Description: http://www.farnell.com/datasheets/1576153.pdf
Q2B = BSO033N03MS G: N-Channel OptiMOS 3 M-Series Power-MOSFET, 30 V VDS, 22 A ID, -55 to 150 degC, PG-DSO-8-16, Reel, Green; Manufacturer 1: INFINEON; Description 1: INFINEON - BSO033N03MS G - MOSFET, N CHANNEL, 30V, 17A, 8DSO; Transistor Polarity: N Channel; Continuous Drain Current Id: 17; Drain Source Voltage Vds: 30; On Resistance Rds(on): 0.0028; Rds(on) Test Voltage Vgs: 10; Threshold Voltage Vgs: 2; No. of Pins: 8; Supplier 1: Newark; Supplier Part Number 1: 47W3322; Manufacturer Part Number: BSO033N03MS G; RoHS: YES; Stock 1: 1339; Pricing 1: 1=0.868, 10=0.742, 25=0.662, 100=0.594, 250=0.525, 500=0.445, 1000=0.389, 2500=0.358 (USD); ComponentLink1URL: http://www.farnell.com/datasheets/1648231.pdf; ComponentLink1Description: http://www.farnell.com/datasheets/1648231.pdf
R8B = 1k, 5%, 100mW, Yageo, R0603: as R5 on sheet Microcontroller; Supplier 1: Newark; Supplier Part Number 1: 68R0220; RoHS: YESX; Stock 1: 36430; Pricing 1: 1=0.06, 10=0.011, 25=0.008, 100=0.005, 250=0.003, 1000=0.002 (USD); Resistance Tolerance: 5%; Packaging: Cut Tape; MSL: -; ComponentLink1URL: http://www.farnell.com/datasheets/1868787.pdf; ComponentLink1Description: http://www.farnell.com/datasheets/1868787.pdf; ComponentLink2URL: http://www.yageo.com/pdf/PYu-RC0603_51_RoHS_L_4.pdf; ComponentLink2Description: http://www.yageo.com/pdf/PYu-RC0603_51_RoHS_L_4.pdf
U6B = LTC4359CMS8#PBF: Ideal Diode Controller with Reverse Input Protection, 4 to 80 V Vin, 8-pin SOP (MS8-8), 0 to 70 degC, Pb-Free; Manufacturer 1: Linear Technology; Description 1: IC OR CTRLR N+1 8MSOP; FET Type: N-Channel; Ratio - Input:Output: N:1; Internal Switch(s): No; Delay Time - ON: 200µs; Delay Time - OFF: 300ns; Current - Supply: 150µA; Voltage - Supply: 4 V ~ 80 V; Supplier 1: Digi-Key; Supplier Part Number 1: LTC4359CMS8#PBF-ND; Manufacturer Part Number: LTC4359CMS8#PBF; RoHS: RoHS Compliant; Category: Integrated Circuits (ICs); Stock 1: 223; Pricing 1: 1=4.5, 25=3, 100=2.55 (USD); Packaging: Tube; Type: N+1 ORing Controller; Current - Output (Max): -; Applications: Automotive, Redundant Power Supplies, Telecom Infrastructure; Operating Temperature: 0°C ~ 70°C; Mounting Type: Surface Mount; Package / Case: 8-TSSOP, 8-MSOP (0.118", 3.00mm Width); Supplier Device Package: 8-MSOP; ComponentLink1URL: http://www.linear.com/docs/41608; ComponentLink1Description: http://www.linear.com/docs/41608

## Nets that join several sheets
GND: Power Board (P1B.10 P5B.2 P6B.2), Microcontroller (13 pins), Power Conditioning (15 pins), U_Power Conditioning/D (C8BB.1 D6BB.2 R8BB.1), U_Power Conditioning/D (C8BA.1 D6BA.2 R8BA.1)
Raw_24V: Microcontroller (C2B.1 U1B.SHDN U1B.Vin), Power Conditioning (5 pins), U_Power Conditioning/D (6 pins), U_Power Conditioning/D (6 pins)
BattA: Power Board (P1B.3 P1B.4), Power Conditioning (C4B.1), U_Power Conditioning/D (8 pins)
BattB: Power Board (P1B.1 P1B.2), Power Conditioning (C5B.1), U_Power Conditioning/D (8 pins)
Elec Pwr Ctrl Signal: Power Board (P8B.1), Microcontroller (U2B.6)
NetP1B_5: Power Board (P1B.5), Power Conditioning (R4B.2 U3B.2)
NetP1B_6: Power Board (P1B.6 P1B.7), Power Conditioning (R5B.2 U4B.2)
NetP1B_8: Power Board (P1B.8), Microcontroller (P2B.2 U2B.10)
NetP1B_9: Power Board (P1B.9), Microcontroller (P2B.1 U2B.11)
NetP5B_1: Power Board (P5B.1), Microcontroller (U2B.13)
NetP6B_1: Power Board (P6B.1), Microcontroller (U2B.12)
NetR1B_2: Microcontroller (R1B.2), Power Conditioning (U3B.4)
NetR2B_2: Microcontroller (R2B.2), Power Conditioning (U4B.4)
NetR4B_1: Microcontroller (U2B.43), Power Conditioning (R4B.1 R6B.2)
NetR5B_1: Microcontroller (U2B.44), Power Conditioning (R5B.1 R7B.2)
Rel1 Driver: Microcontroller (U2B.5), Power Conditioning (Q1B.G)
SHDN_Signal: Microcontroller (U2B.4), Power Conditioning (S2B.3 S2B.4)